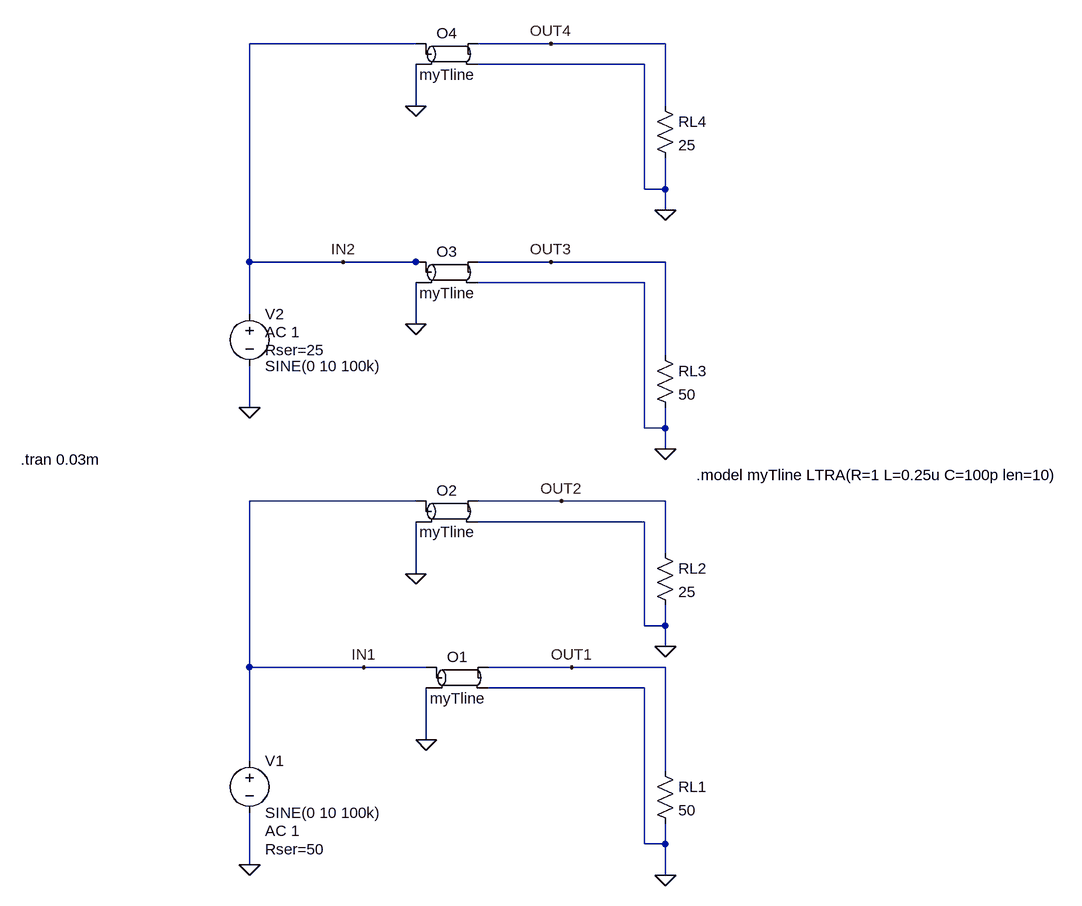
[diagram p0: schematic Lossy.asc]
Lossy.asc, the LTspice schematic file:
Version 4
SHEET 1 2592 680
WIRE 1552 -800 1296 -800
WIRE 1760 -800 1648 -800
WIRE 1936 -800 1760 -800
WIRE 1904 -768 1648 -768
WIRE 1552 -704 1552 -768
WIRE 1936 -704 1936 -800
WIRE 1904 -576 1904 -768
WIRE 1936 -576 1936 -624
WIRE 1936 -576 1904 -576
WIRE 1936 -544 1936 -576
WIRE 1296 -464 1296 -800
WIRE 1440 -464 1296 -464
WIRE 1552 -464 1440 -464
WIRE 1568 -464 1552 -464
WIRE 1760 -464 1648 -464
WIRE 1936 -464 1760 -464
WIRE 1904 -432 1648 -432
WIRE 1296 -384 1296 -464
WIRE 1552 -368 1552 -432
WIRE 1936 -320 1936 -464
WIRE 1296 -240 1296 -304
WIRE 1904 -208 1904 -432
WIRE 1936 -208 1936 -240
WIRE 1936 -208 1904 -208
WIRE 1936 -176 1936 -208
WIRE 1552 -96 1296 -96
WIRE 1776 -96 1648 -96
WIRE 1936 -96 1776 -96
WIRE 1904 -64 1648 -64
WIRE 1936 -16 1936 -96
WIRE 1552 16 1552 -64
WIRE 1904 96 1904 -64
WIRE 1936 96 1936 64
WIRE 1936 96 1904 96
WIRE 1936 128 1936 96
WIRE 1296 160 1296 -96
WIRE 1472 160 1296 160
WIRE 1568 160 1472 160
WIRE 1792 160 1664 160
WIRE 1936 160 1792 160
WIRE 1904 192 1664 192
WIRE 1568 272 1568 192
WIRE 1296 304 1296 160
WIRE 1936 320 1936 160
WIRE 1904 432 1904 192
WIRE 1936 432 1936 400
WIRE 1936 432 1904 432
WIRE 1296 464 1296 384
WIRE 1936 480 1936 432
FLAG 1296 464 0
FLAG 1568 272 0
FLAG 1936 480 0
FLAG 1936 128 0
FLAG 1552 16 0
FLAG 1296 -240 0
FLAG 1552 -704 0
FLAG 1552 -368 0
FLAG 1936 -176 0
FLAG 1936 -544 0
FLAG 1472 160 IN1
FLAG 1440 -464 IN2
FLAG 1792 160 OUT1
FLAG 1776 -96 OUT2
FLAG 1760 -464 OUT3
FLAG 1760 -800 OUT4
SYMBOL voltage 1296 288 R0
WINDOW 123 24 124 Left 2
WINDOW 39 24 152 Left 2
SYMATTR Value2 AC 1
SYMATTR SpiceLine Rser=50
SYMATTR InstName V1
SYMATTR Value SINE(0 10 100k)
SYMBOL ltline 1616 176 R0
SYMATTR InstName O1
SYMATTR Value myTline
SYMBOL ltline 1600 -80 R0
SYMATTR InstName O2
SYMATTR Value myTline
SYMBOL res 1920 -32 R0
SYMATTR InstName RL2
SYMATTR Value 25
SYMBOL res 1920 304 R0
SYMATTR InstName RL1
SYMATTR Value 50
SYMBOL ltline 1600 -448 R0
SYMATTR InstName O3
SYMATTR Value myTline
SYMBOL ltline 1600 -784 R0
SYMATTR InstName O4
SYMATTR Value myTline
SYMBOL voltage 1296 -400 R0
WINDOW 123 24 44 Left 2
WINDOW 39 24 72 Left 2
SYMATTR Value2 AC 1
SYMATTR SpiceLine Rser=25
SYMATTR InstName V2
SYMATTR Value SINE(0 10 100k)
SYMBOL res 1920 -720 R0
SYMATTR InstName RL4
SYMATTR Value 25
SYMBOL res 1920 -336 R0
SYMATTR InstName RL3
SYMATTR Value 50
TEXT 1984 -136 Left 2 !.model myTline LTRA(R=1 L=0.25u C=100p len=10)
TEXT 944 -160 Left 2 !.tran 0.03m

The netlist it stands for:
* Lossy.asc
V1 IN1 0 SINE(0 10 100k) AC 1 Rser=50
O1 IN1 0 OUT1 0 myTline
O2 IN1 0 OUT2 0 myTline
RL2 OUT2 0 25
RL1 OUT1 0 50
O3 IN2 0 OUT3 0 myTline
O4 IN2 0 OUT4 0 myTline
V2 IN2 0 SINE(0 10 100k) AC 1 Rser=25
RL4 OUT4 0 25
RL3 OUT3 0 50
.model myTline LTRA(R=1 L=0.25u C=100p len=10)
.tran 0.03m
.backanno
.end